# EAGLE design Main-avionics-3.5-wp (EAGLE 9.6.2)
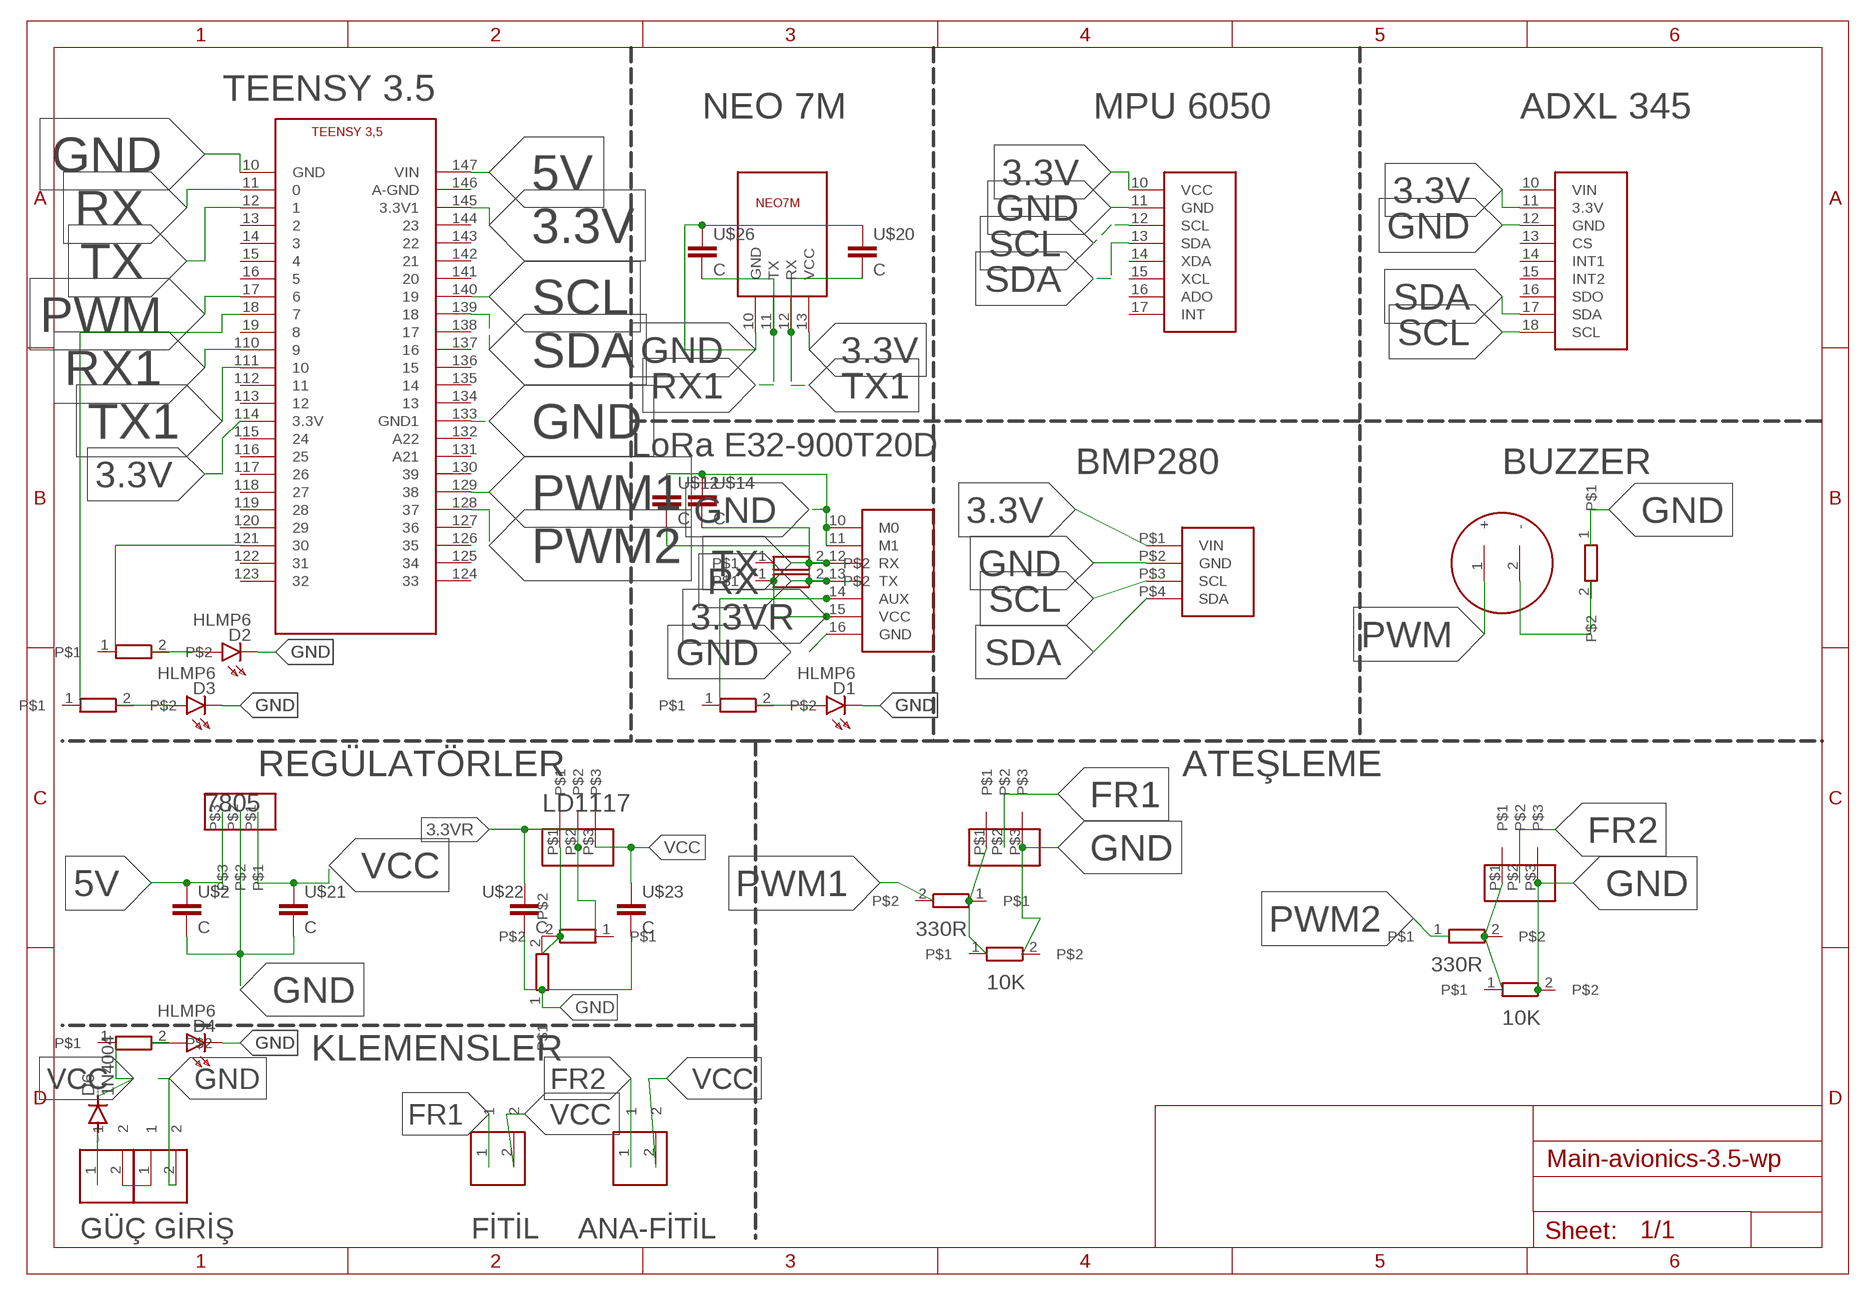
[diagram p0: schematic, sheet 1]

## Parts
1K  R  [0204/7]
10R  R  [0204/7]
10R1  R  [0204/7]
10R2  R  [0204/7]
10R3  R  [0204/7]
10R4  R  [0204/7]
10R5  R  [0204/7]
10R6  R  [0204/7]
10R7  R  [0204/7]
10R8  R  [0204/7]
D1  HLMP6  [HLMP6]
D2  HLMP6  [HLMP6]
D3  HLMP6  [HLMP6]
D4  HLMP6  [HLMP6]
D6  1N4004  [DO41-10]
U$1  ADXL345  [ADXL345]
U$2  C  [C075-032X103]
U$3  BUZZEER  [BUZZER]
U$4  KLEMENS  [KLEMENS]
U$5  KLEMENS  [KLEMENS]
U$6  BMP280  [BMP280]
U$7  KLEMENS  [KLEMENS]
U$8  NEO7M  [NEO7M]
U$9  REGULATOR  [REGULATOR]
U$10  LORA  [LORA]
U$11  TEENSY  [TEENSY]
U$12  C  [C075-032X103]
U$13  MPU6050  [MPU6050]
U$14  C  [C075-032X103]
U$15  R  [0204/7]
U$16  KLEMENS  [KLEMENS]
U$17  R  [0204/7]
U$18  R  [0204/7]
U$19  REGULATOR  [REGULATOR]
U$20  C  [C075-032X103]
U$21  C  [C075-032X103]
U$22  C  [C075-032X103]
U$23  C  [C075-032X103]
U$24  REGULATOR  [REGULATOR]
U$25  REGULATOR  [REGULATOR]
U$26  C  [C075-032X103]

## Nets
3.3V: U$1.11(3.3V) U$6.P$1(VIN) U$8.13(VCC) U$11.114(3.3V) U$11.145(3.3V1) U$13.10(VCC)
3.3VR: 10R1.1 10R2.1 10R4.1 U$10.15(VCC) U$22.1 U$24.P$2
5V: U$2.1 U$11.147(VIN) U$19.P$3
FR1: U$4.1 U$25.P$2
FR2: U$7.1 U$9.P$2
GND: 10R5.1 10R.2 D1.K D2.K D3.K D4.K U$1.12(GND) U$2.2 U$6.P$2(GND) U$8.10(GND) U$9.P$3 U$10.10(M0) U$10.11(M1) U$10.16(GND) U$11.10(GND) U$11.133(GND1) U$12.1 U$13.11(GND) U$14.1 U$15.1 U$16.2 U$18.2 U$19.P$2 U$20.1 U$21.2 U$22.2 U$23.2 U$25.P$3 U$26.1
N$1: U$3.2(-) U$15.2
N$2: U$9.P$1 U$17.2 U$18.1
N$3: 10R3.2 D1.A
N$4: 10R3.1 U$10.14(AUX)
N$5: D6.A U$5.1
N$6: 1K.1 10R.1 U$25.P$1
N$7: U$5.2 U$16.1
N$10: 10R6.2 D2.A
N$11: 10R6.1 U$11.121
N$12: 10R7.2 D3.A
N$13: 10R7.1 U$11.18
N$14: 10R8.2 D4.A
PWM: U$3.1(+) U$11.17
PWM1: 1K.2 U$11.129
PWM2: U$11.128 U$17.1
RX: 10R2.2 U$10.13(TX) U$11.11 U$12.2
RX1: U$8.11(TX) U$11.110 U$26.2
SCL: U$1.18(SCL) U$6.P$3(SCL) U$11.140 U$13.12(SCL)
SDA: U$1.17(SDA) U$6.P$4(SDA) U$11.139 U$13.13(SDA)
T: 10R4.2 10R5.2 U$24.P$1
TX: 10R1.2 U$10.12(RX) U$11.12 U$14.2
TX1: U$8.12(RX) U$11.111 U$20.2
VCC: 10R8.1 D6.C U$4.2 U$7.2 U$19.P$1 U$21.1 U$23.1 U$24.P$3
Unconnected: U$1.10(VIN) U$1.13(CS) U$1.14(INT1) U$1.15(INT2) U$1.16(SDO) U$11.13 U$11.14 U$11.15 U$11.16 U$11.19 U$11.112 U$11.113 U$11.115 U$11.116 U$11.117 U$11.118 U$11.119 U$11.120 U$11.122 U$11.123 U$11.124 U$11.125 U$11.126 U$11.127 U$11.130 U$11.131(A21) U$11.132(A22) U$11.134 U$11.135 U$11.136 U$11.137 U$11.138 U$11.141 U$11.142 U$11.143 U$11.144 U$11.146(A-GND) U$13.14(XDA) U$13.15(XCL) U$13.16(ADO) U$13.17(INT)

## Notes on the sheet
- TEENSY 3.5
- NEO 7M | MPU 6050 | ADXL 345
- LoRa E32-900T20D
- BMP280 | BUZZER
- REGÜLATÖRLER | ATEŞLEME
- 7805 | LD1117
- 330R
- 330R
- 10K
- 10K
- KLEMENSLER
- GÜÇ GİRİŞ | FİTİL | ANA-FİTİL

## Library data of the parts
1K 10R 10R1-10R8 U$15 U$17 U$18 = KARTSON:R
D1-D4 = display-hp:HLMP6: LED 2mm horizontal; MF: AGILENT TECHNOLOGIES; MPN: HLMP-6500; OC_FARNELL: 1652490; OC_NEWARK: 40K0088
D6 = diode:1N4004: DIODE general purpose rectifier, 1 A
U$1 = KARTSON:ADXL345
U$2 U$12 U$14 U$20-U$23 U$26 = KARTSON-RE:C
U$3 = KARTSON:BUZZEER
U$4 U$7 = KARTSON:KLEMENS
U$5 U$16 = KARTYENİ:KLEMENS
U$6 = KARTSON-RE:BMP280
U$8 = KARTYENİ:NEO7M
U$9 U$19 U$24 U$25 = KARTSON-RE:REGULATOR
U$10 = KARTSON-RE:LORA
U$11 = KARTSON:TEENSY
U$13 = KARTSON:MPU6050

## Board
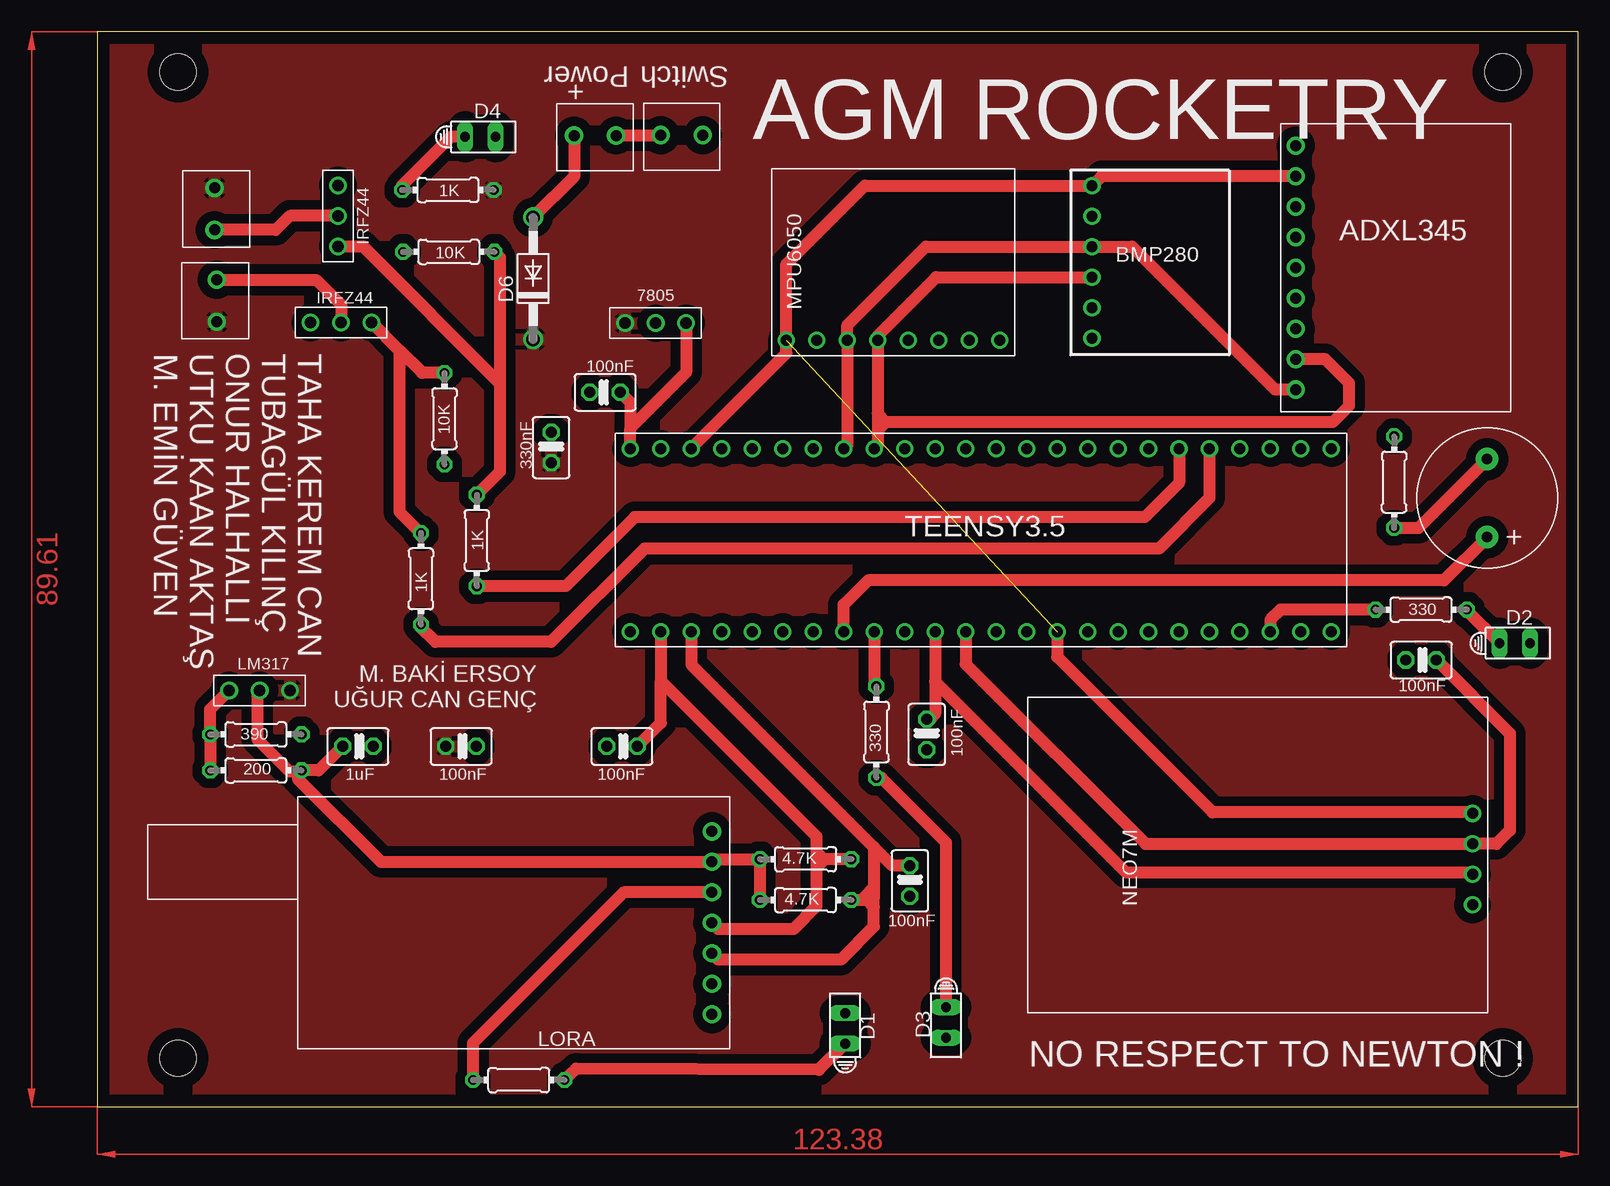
[diagram p1: board, top side]
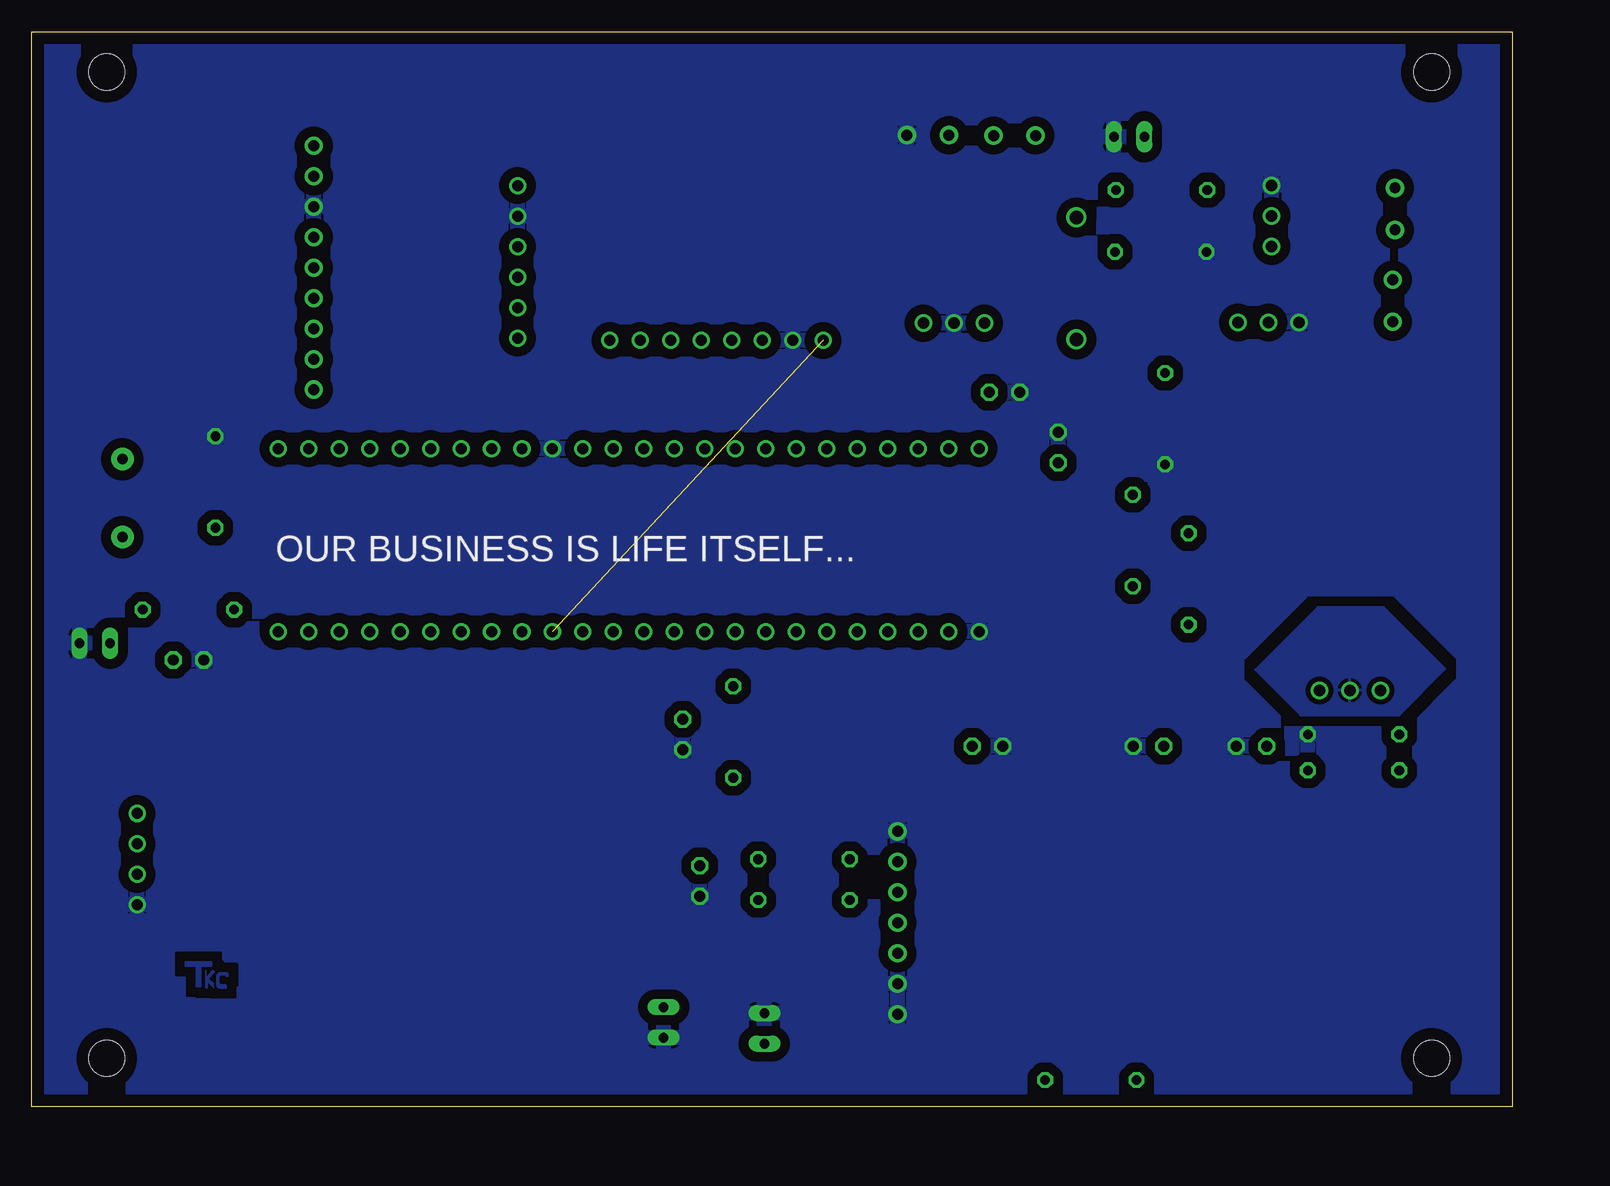
[diagram p2: board, bottom side, seen from below]

Size 123.38 x 89.61 mm. Coordinates in mm from the lower left corner, seen from the top.
Outline: 0,0 123.38,0 123.38,89.61 0,89.61 0,0
Copper layers (1*16): Top 0.035mm / dielectric 1.5mm / Bottom 0.035mm
Design rules "default": minimum track width 6mil, minimum drill 0.35mm, track to track 6mil, track to pad 6mil, pad to pad 6mil, via to via 6mil, smd to smd 6mil, copper to edge 40mil, drill to drill 6mil, minimum pad ring 10mil, minimum via ring 8mil, stop-mask expansion 4mil, vias tented up to drill 0mil, thermal gap 10mil
Holes 3 mm at 117.11,86.24 117.11,4.04 6.71,86.24 6.71,4.04

### Footprints (pad centres in the part's own frame; a part is rotated, then mirrored left to right if it is on the bottom)
0204/7 = drill 0.813 octagon: 1 -3.81,0; 2 3.81,0
HLMP6 = drill 0.813 long: A -1.27,0; K 1.27,0
DO41-10 = drill 1.118: A 5.08,0; C -5.08,0
ADXL345 = drill 0.914 pad 1.524: 10 1.27,22.16; 11 1.27,19.62; 12 1.27,17.08; 13 1.27,14.54; 14 1.27,12; 15 1.27,9.46; 16 1.27,6.92; 17 1.27,4.38; 18 1.27,1.84
C075-032X103 = drill 0.914 octagon: 1 -1.27,0; 2 1.27,0
BUZZER = drill 0.889 pad 1.88: 1 -3.251,0; 2 3.251,0
KLEMENS = drill 0.914 pad 1.524: 1 1.425,2.94; 2 4.925,2.94
BMP280 = drill 0.914: P$1 11.43,1.27; P$2 11.43,3.81; P$3 11.43,6.35; P$4 11.43,8.89; P$5 11.43,11.43; P$6 11.43,13.97
NEO7M = drill 0.914: 10 9,1.27; 11 11.54,1.27; 12 14.08,1.27; 13 16.62,1.27
REGULATOR = drill 0.965: P$1 1.27,1.27; P$2 3.81,1.27; P$3 6.35,1.27
LORA = drill 0.914 pad 1.524: 10 1.5,18.12; 11 1.5,15.58; 12 1.5,13.04; 13 1.5,10.5; 14 1.5,7.96; 15 1.5,5.42; 16 1.5,2.88
TEENSY = drill 0.914: 10 1.27,59.69; 11 1.27,57.15; 12 1.27,54.61; 13 1.27,52.07; 14 1.27,49.53; 15 1.27,46.99; 16 1.27,44.45; 17 1.27,41.91; 18 1.27,39.37; 19 1.27,36.83; 110 1.27,34.29; 111 1.27,31.75; 112 1.27,29.21; 113 1.27,26.67; 114 1.27,24.13; 115 1.27,21.59; 116 1.27,19.05; 117 1.27,16.51; 118 1.27,13.97; 119 1.27,11.43; 120 1.27,8.89; 121 1.27,6.35; 122 1.27,3.81; 123 1.27,1.27; 124 16.51,1.27; 125 16.51,3.81; 126 16.51,6.35; 127 16.51,8.89; 128 16.51,11.43; 129 16.51,13.97; 130 16.51,16.51; 131 16.51,19.05; 132 16.51,21.59; 133 16.51,24.13; 134 16.51,26.67; 135 16.51,29.21; 136 16.51,31.75; 137 16.51,34.29; 138 16.51,36.83; 139 16.51,39.37; 140 16.51,41.91; 141 16.51,44.45; 142 16.51,46.99; 143 16.51,49.53; 144 16.51,52.07; 145 16.51,54.61; 146 16.51,57.15; 147 16.51,59.69
MPU6050 = drill 0.914: 10 1.27,19.05; 11 1.27,16.51; 12 1.27,13.97; 13 1.27,11.43; 14 1.27,8.89; 15 1.27,6.35; 16 1.27,3.81; 17 1.27,1.27

### Placement (x,y rotation side)
1K  31.61,47.2 270 top
10R  29.28,71.25 180 top
10R1  59.01,17.24 0 top
10R2  59.01,20.64 0 top
10R3  35.11,2.24 0 top
10R4  13.21,28.04 180 top
10R5  13.21,31.04 180 top
10R6  110.31,41.44 0 top
10R7  64.91,31.24 270 top
10R8  29.21,76.41 180 top
D1  62.31,6.54 90 top
D2  118.11,38.64 0 top
D3  70.71,7.04 270 top
D4  31.91,80.84 0 top
D6  36.31,69.04 90 top
U$1  98.59,57.93 0 top
U$2  42.31,59.54 180 top
U$3  115.81,50.73 90 top
U$4  12.7,71.65 90 top
U$5  38.29,78 0 top
U$6  94.31,78.04 180 top
U$7  7.01,70.35 270 top
U$8  115.86,7.83 90 top
U$9  24.11,66.64 180 top
U$10  52.71,25.84 180 top
U$11  104.1,38.34 90 top
U$12  43.71,30.04 0 top
U$13  76.46,62.61 90 top
U$14  67.71,18.84 90 top
U$15  108.06,52.07 270 top
U$16  45.51,78.04 0 top
U$17  26.96,44 90 top
U$18  28.92,57.35 270 top
U$19  42.71,64.04 0 top
U$20  110.31,37.24 0 top
U$21  30.31,30.04 0 top
U$22  21.71,30.04 0 top
U$23  37.81,54.94 90 top
U$24  9.71,33.44 0 top
U$25  21.31,70.44 90 top
U$26  69.11,31.04 90 top

### Tracks (layer width: path | path; a pad name or v marks a point on that pad's centre or on a via)
3.3V  (1 unrouted)
  Top 1.016: U$11.145 49.49,54.89 57.41,62.81 U$13.10 57.41,70.23 63.95,76.77 U$6.P$1 83.68,77.57 99.84,77.57 U$1.11 | U$11.114 79.97,37.51 92.93,24.55 114.49,24.55 U$8.13
3.3VR
  Top 1.016: 10R4.1 16.71,27.73 16.71,27.34 23.63,20.42 U$10.15 51.43,20.64 10R2.1 10R1.1 | U$22.1 18.44,28.04 10R4.1 | 10R4.1 16.92,27.94 16.01,27.94 13.32,30.63 13.32,34.51 U$24.P$2
  pour Bottom (isolate 0.406): 5.56,36.49 9.41,32.64 17.61,32.64 21.41,36.44 16.21,41.64 10.71,41.64
5V
  Top 1.016: U$11.147 44.41,56.55 | U$19.P$3 49.06,61.2 44.41,56.55 | U$2.1 44.41,58.71 44.41,56.55
C
  pour Bottom: 107.01,10.94 arc-90 107.21,11.14 107.61,11.14 arc-90 107.91,10.84 107.91,10.24 arc-90 107.61,9.94 107.21,9.94 107.21,10.04 arc-90 107.31,10.14 107.61,10.14 arc90 107.81,10.34 107.81,10.84 arc90 107.61,11.04 107.21,11.04 arc90 107.11,10.94
FR1
  Top 1.016: U$25.P$2 16.03,74.25 14.86,73.08 U$4.1
FR2
  Top 1.016: U$7.1 18.23,68.93 20.3,66.85 U$9.P$2
GND
  pour Bottom (isolate 0.813, rank 2): -9.49,83.24 4.51,97.24 117.71,97.24 123.71,97.24 135.71,85.24 135.71,10.24 135.91,10.04 135.91,5.64 121.91,-8.36 120.31,-9.96 4.71,-9.96 -11.09,5.84 -11.09,7.24 -11.09,81.44 -9.49,83.04
K
  pour Bottom: 108.91,11.34 108.91,9.94 108.71,9.94 108.71,10.44 108.21,9.94 108.21,10.24 108.61,10.64 108.71,10.64 108.11,11.24 108.26,11.39 108.71,10.94 108.71,10.84 108.81,10.94 108.81,11.34
N$1
  Top 1.016: U$15.2 110.09,48.26 U$3.2
N$2
  Top 1.016: 25.16,63.05 25.16,49.61 U$17.2 | 25.16,63.05 U$9.P$1 | U$18.1 27.05,61.16 25.16,63.05
N$3
  Top 1.016: D1.A 60.13,3.09 39.89,3.19 10R3.2
N$4
  Top 1.016: 10R3.1 31.3,5.33 43.85,17.88 U$10.14
N$5
  Top 1.016: U$5.1 39.72,77.53 D6.A
N$6
  Top 1.016: U$25.P$1 22.11,71.71 33.55,60.27 | 10R.1 33.55,70.8 33.55,60.27 | 1K.1 33.55,52.95 33.55,60.27
N$7
  Top 1.016: U$5.2 43.26,80.98 U$16.1
N$10
  Top 1.016: D2.A 114.12,41.36 10R6.2
N$11
  Top 1.016: 10R6.1 98.6,41.44 97.75,40.59 U$11.121
N$12
  Top 1.016: 10R7.2 65.32,27.43 70.71,22.04 D3.A
N$13
  Top 1.016: U$11.18 64.73,35.23 10R7.1
N$14
  Top 1.016: 10R8.2 25.4,76.8 29.44,80.84 D4.A
PWM
  Top 1.016: U$11.17 62.19,41.85 64.22,43.88 112.21,43.88 U$3.1
PWM1
  Top 1.016: U$11.129 90.13,52.01 87.26,49.14 44.76,49.14 39.01,43.39 1K.2
PWM2
  Top 1.016: U$11.128 92.67,50.74 88.46,46.53 45.6,46.53 37.81,38.74 28.16,38.74 26.84,40.06 U$17.1
RX
  Top 1.016: U$11.11 46.95,35.5 | 10R2.2 60.61,20.64 | 60.61,20.64 60.51,20.64 59.91,21.24 | 59.91,21.24 59.91,22.54 46.95,35.5 | 59.91,21.24 59.91,19.94 | 59.91,19.94 59.91,16.74 57.99,14.82 51.73,14.82 U$10.13 | 60.61,20.64 59.91,19.94 | U$12.2 46.95,32.01 46.95,35.5
RX1
  Top 1.016: U$11.110 69.81,35.44 | 69.81,35.44 85.71,19.54 114.42,19.54 U$8.11 | 69.81,35.44 69.81,32.74 69.38,32.31 U$26.2
SCL
  Top 1.016: U$11.140 62.49,55.15 U$13.12 62.49,65.15 69.03,71.69 U$6.P$3 86.23,71.69 98.15,59.77 U$1.18
SDA
  Top 1.016: U$1.17 102.31,62.31 104.31,60.31 104.31,58.44 102.93,57.06 65.71,57.06 | U$6.P$4 69.9,69.15 65.03,64.28 U$13.13 65.03,57.84 65.03,57.74 | 65.03,57.06 65.71,57.06 | 65.03,57.74 65.03,56.38 | 65.03,56.38 65.03,55.15 U$11.139 | 65.03,56.38 65.71,57.06 | 65.71,57.06 65.03,57.74
T
  Top 1.016: 10R5.2 9.4,31.18 | 10R5.2 10R4.2 | 10R5.2 9.4,33.13 U$24.P$1
TKC
  pour Bottom: 109.31,11.64 109.31,10.04 109.61,10.04 109.61,11.74 110.51,11.74 110.51,12.04 108.41,12.04 108.41,11.74 109.21,11.74
TX
  Top 1.016: U$11.12 49.49,36.86 64.71,21.64 | 64.71,21.64 64.71,18.24 | 64.71,18.24 64.71,17.44 | 10R1.2 64.11,17.24 | 64.71,17.44 63.91,17.44 | 64.71,16.64 64.71,15.04 61.95,12.28 51.73,12.28 U$10.12 | 64.71,16.64 64.71,17.44 | 63.91,17.44 64.71,18.24 | 63.91,17.44 64.11,17.24 | 64.11,17.24 64.71,16.64 | U$14.2 66.24,20.11 64.71,21.64
TX1
  Top 1.016: U$11.111 72.35,36.9 87.34,21.91 U$8.12 116.58,21.91 117.71,23.04 117.71,31.11 U$20.2
VCC
  pour Top (isolate 0.813, rank 2): -28.09,77.44 -0.49,105.04 14.31,105.04 125.51,105.04 134.51,96.04 146.11,84.44 146.11,79.44 146.11,6.64 119.71,-19.76 1.11,-19.76 -28.09,9.44
(copper drawn outside any net)
  shapes: Top area x2

### Text on the board
tPlace: Power | Switch | + | AGM ROCKETRY | 1K | IRFZ44 | ADXL345 | 10K | IRFZ44 | 7805 | TAHA KEREM CAN / TUBAGÜL KILINÇ / ONUR HALHALLI / UTKU KAAN AKTAŞ / M. EMİN GÜVEN | 100nF | 10K | 330nF | TEENSY3.5 | + | 1K | 1K | 330 | M. BAKİ ERSOY / UĞUR CAN GENÇ | LM317 | 100nF | 390 | 330 | 100nF | 200 | 1uF | 100nF | 100nF | 4.7K | 4.7K | 100nF | NO RESPECT TO NEWTON !
bPlace: OUR BUSINESS IS LIFE ITSELF...